# EAGLE design board (EAGLE 9.6.2)

## Sheet 1 of 2
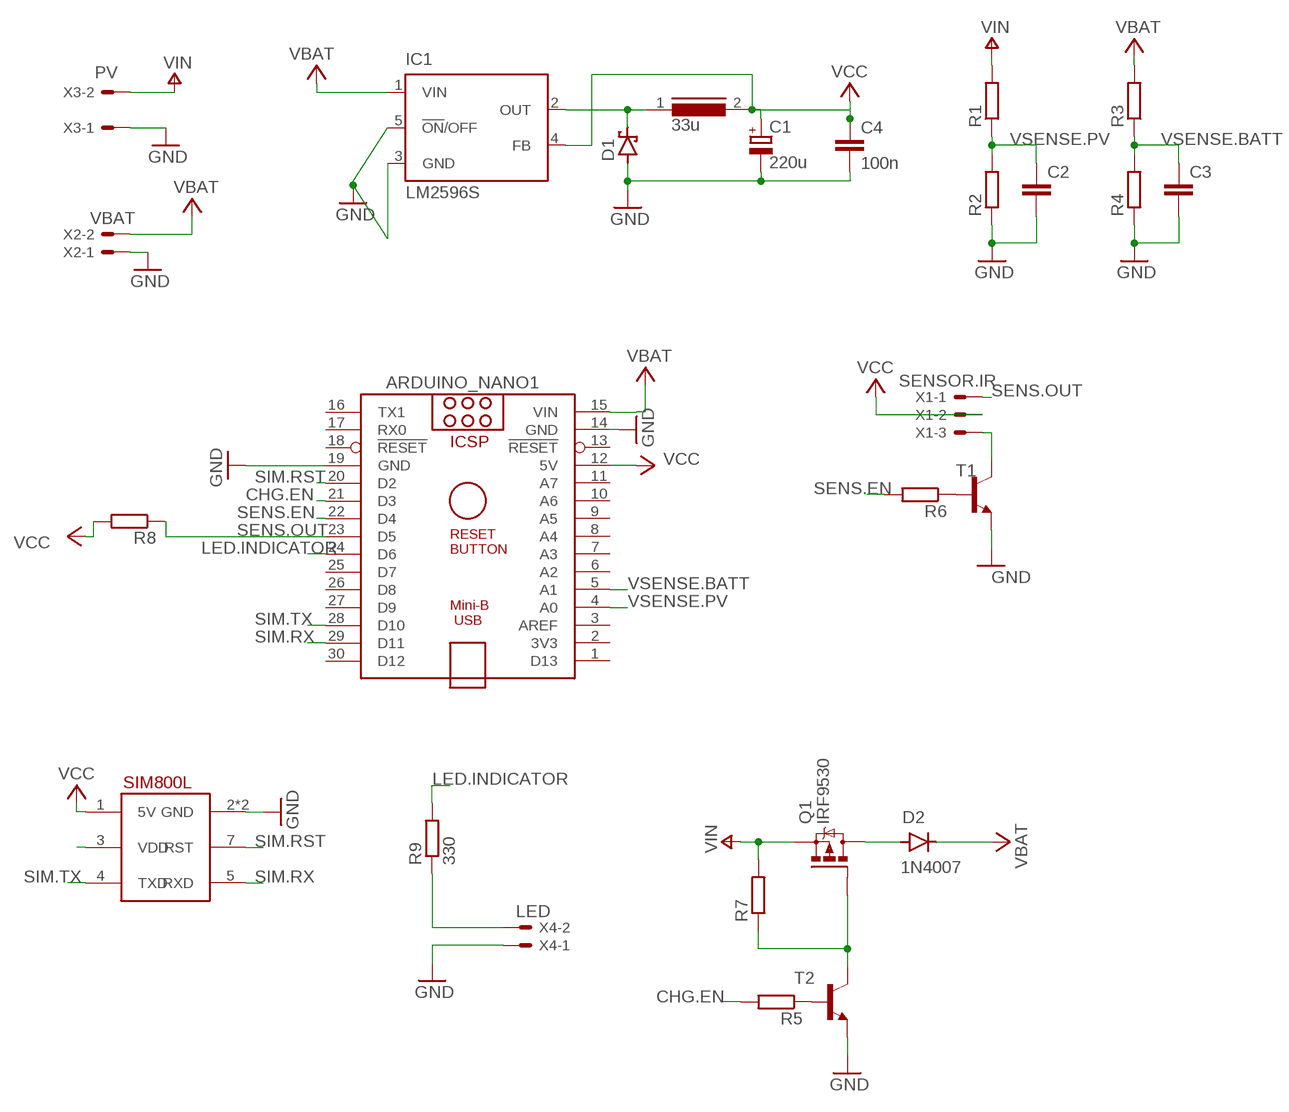
[diagram p0: schematic, sheet 1]

### Parts
ARDUINO_NANO1  ARDUINO_NANO  [ARDUINO_NANO]
C1  220u  CPOL-EU153CLV-0810  [153CLV-0810]
C2  C-EUC0805  [C0805]
C3  C-EUC0805  [C0805]
C4  100n  C-EUC0805  [C0805]
D1  SCHOTTKY-DIODESMD  [SMB]
D2  1N4007  [DO-41]
IC1  LM2596S  [TO263-5]
L2  33u  DR125  [DR125]
Q1  IRF9530  [TO220BV]
R1  R-EU_R0805  [R0805]
R2  R-EU_R0805  [R0805]
R3  R-EU_R0805  [R0805]
R4  R-EU_R0805  [R0805]
R5  R-EU_0207/7  [0207/7]
R6  R-EU_0207/7  [0207/7]
R7  R-EU_0207/7  [0207/7]
R8  R-EU_0207/7  [0207/7]
R9  330  R-EU_R0805  [R0805]
T1  -NPN-TO92-ECB  [TO92-ECB]
T2  -NPN-TO92-ECB  [TO92-ECB]
U$1  SIM800L  [SIP]
X1  SENSOR.IR  JST-XH-03-PIN-LONG-PAD  [JST-XH-03-PACKAGE-LONG-PAD]
X2  VBAT  JST-XH-02-PIN-LONG-PAD  [JST-XH-02-PACKAGE-LONG-PAD]
X3  PV  KK-156-2  [KK-156-2]
X4  LED  JST-XH-02-PIN-LONG-PAD  [JST-XH-02-PACKAGE-LONG-PAD]

### Nets
+5V: ARDUINO_NANO1.15(VIN) D2.C IC1.1(VIN) R3.2 X2.2 ; supply symbol labelled VBAT
CHG.EN: ARDUINO_NANO1.21(D3) R5.2
GND: ARDUINO_NANO1.14(GND) ARDUINO_NANO1.19(GND) C1.- C2.2 C3.2 C4.2 D1.A IC1.3(GND) IC1.5(!ON!/OFF) R2.1 R4.1 T1.E T2.E U$1.2(GND) U$1.6(GND) X2.1 X3.1 X4.1
LED.INDICATOR: ARDUINO_NANO1.24(D6) R9.2
N$4: T1.C X1.3
N$5: R6.1 T1.B
N$7: U$1.3(VDD)
N$8: R9.1 X4.2
N$9: D1.C IC1.2(OUT) L2.1
N$14: Q1.G R7.1 T2.C
N$19: D2.A Q1.D
N$20: R5.1 T2.B
SENS.EN: ARDUINO_NANO1.22(D4) R6.2
SENS.OUT: ARDUINO_NANO1.23(D5) R8.1 X1.1
SIM.RST: ARDUINO_NANO1.20(D2) U$1.7(RST)
SIM.RX: ARDUINO_NANO1.29(D11) U$1.5(RXD)
SIM.TX: ARDUINO_NANO1.28(D10) U$1.4(TXD)
V+: Q1.S R1.2 R7.2 X3.2 ; supply symbol labelled VIN
VCC: ARDUINO_NANO1.12(5V) C1.+ C4.1 IC1.4(FB) L2.2 R8.2 U$1.1(5V) X1.2
VSENSE.BATT: ARDUINO_NANO1.5(A1) C3.1 R3.1 R4.2
VSENSE.PV: ARDUINO_NANO1.4(A0) C2.1 R1.1 R2.2
Unconnected: ARDUINO_NANO1.1(D13) ARDUINO_NANO1.2(3V3) ARDUINO_NANO1.3(AREF) ARDUINO_NANO1.6(A2) ARDUINO_NANO1.7(A3) ARDUINO_NANO1.8(A4) ARDUINO_NANO1.9(A5) ARDUINO_NANO1.10(A6) ARDUINO_NANO1.11(A7) ARDUINO_NANO1.13(!RESET) ARDUINO_NANO1.16(TX1) ARDUINO_NANO1.17(RX0) ARDUINO_NANO1.18(!RESET) ARDUINO_NANO1.25(D7) ARDUINO_NANO1.26(D8) ARDUINO_NANO1.27(D9) ARDUINO_NANO1.30(D12)

## Sheet 2 of 2

## Library data of the parts
ARDUINO_NANO1 = ArduinoNanoV30:ARDUINO_NANO: Arduino Nano V3.0 Overview: The Arduino Nano is a small, complete, and breadboard-friendly board based on the ATmega328 (Arduino Nano 3.x) or ATmega168 (Arduino Nano 2.x). It has more or less the same functionality of the Arduino Duemilanove, but in a different package. It lacks only a DC power jack, and works with a Mini-B USB cable instead of a standard one. The Nano was designed and is being produced by Gravitech. Specifications: Microcontroller Atmel ATmega168 or ATmega328 Operating Voltage (logic level) 5 V Input Voltage (recommended) 7-12 V Input Voltage (limits) 6-20 V Digital I/O Pins 14 (of which 6 provide PWM output) Analog Input Pins 8 DC Current per I/O Pin 40 mA Flash Memory 16 KB (ATmega168) or 32 KB (ATmega328) of which 2 KB used by bootloader SRAM 1 KB (ATmega168) or 2 KB (ATmega328) EEPROM 512 bytes (ATmega168) or 1 KB (ATmega328) Clock Speed 16 MHz Dimensions 0.73" x 1.70" Length 45 mm Width 18 mm Weigth 5 g Power: The Arduino Nano can be powered via the Mini-B USB connection, 6-20V unregulated external power supply (pin 30), or 5V regulated external power supply (pin 27). The power source is automatically selected to the highest voltage source. Memory: The ATmega168 has 16 KB of flash memory for storing code (of which 2 KB is used for the bootloader); the ATmega328 has 32 KB, (also with 2 KB used for the bootloader). The ATmega168 has 1 KB of SRAM and 512 bytes of EEPROM (which can be read and written with the EEPROM library); the ATmega328 has 2 KB of SRAM and 1 KB of EEPROM. Input and Output: Each of the 14 digital pins on the Nano can be used as an input or output, using pinMode(), digitalWrite(), and digitalRead() functions. They operate at 5 volts. Each pin can provide or receive a maximum of 40 mA and has an internal pull-up resistor (disconnected by default) of 20-50 kOhms. In addition, some pins have specialized functions. Visit Arduino - ArduinoBoardNano <https://www.arduino.cc/en/Main/ArduinoBoardNano>
C1 = rcl:CPOL-EU: POLARIZED CAPACITOR, European symbol; SPICEPREFIX: C
C2-C4 = rcl:C-EU: CAPACITOR, European symbol; SPICEPREFIX: C
D1 = diode:SCHOTTKY-DIODE: Schottky Diode
D2 = Diodes:1N4007: DIODE GEN PURP 1KV 1A DO41 Manufacturer's datasheet <https://www.mccsemi.com/pdf/Products/1N4001-1N4007(DO-41).pdf>; CREATED_BY: PCBLayout.com; DIGIKEY_PART_NUMBER: 1N4007MSCT-ND; MANUFACTURER: Micro Commercial Co; MPN: 1N4007; PACKAGE: DO-41
IC1 = national-semiconductor:LM2596: SIMPLE SWITCHER® Power Converter 150 kHz 3A Step-Down Voltage Regulator Source: http://www.national.com/ds/LM/LM2596.pdf; MF: NATIONAL SEMICONDUCTOR; MPN: LM2596S-ADJ/NOPB; OC_FARNELL: 9494367; OC_NEWARK: 41K3842
L2 = DR125:DR125: High Power Density, High Efficiency, Shielded Inductors Source: coiltronics_dr_series.pdf; SPICEPREFIX: L
Q1 = transistor-power:IRF9530: P-CHANNEL HEXFET POWER-MOS-FET Source: http://www.irf.com/product-info/datasheets/data/irf9530.pdf
R1-R9 = rcl:R-EU_: RESISTOR, European symbol; SPICEPREFIX: R
T1 T2 = transistor:*-NPN-: NPN Transistror BF959 corrected 2008.03.06
U$1 = SIM800L:SIM800L: SIM800L Blue EVB Board with Level Translation and diode dropper.
X1 = Rembrandt Electronics - JST XH Connectors v1-0-2-2-2-2:JST-XH-03-PIN: JST XH Connector 2 Pin Wire to board connector. Pitch: 2,54 mm, (0.100") Number of pins: 3 Created by Rembrandt Electronics www.rembrandtelectronics.com
X2 X4 = Rembrandt Electronics - JST XH Connectors v1-0-2-2-2-2:JST-XH-02-PIN: JST XH Connector 2 Pin Wire to board connector. Pitch: 2,54 mm, (0.100") Number of pins: 2 Created by Rembrandt Electronics www.rembrandtelectronics.com
X3 = con-molex:KK-156-2: KK 156 HEADER Source: http://www.molex.com/pdm_docs/sd/026604100_sd.pdf; MF: MOLEX; OC_FARNELL: unknown; OC_NEWARK: unknown

## Board
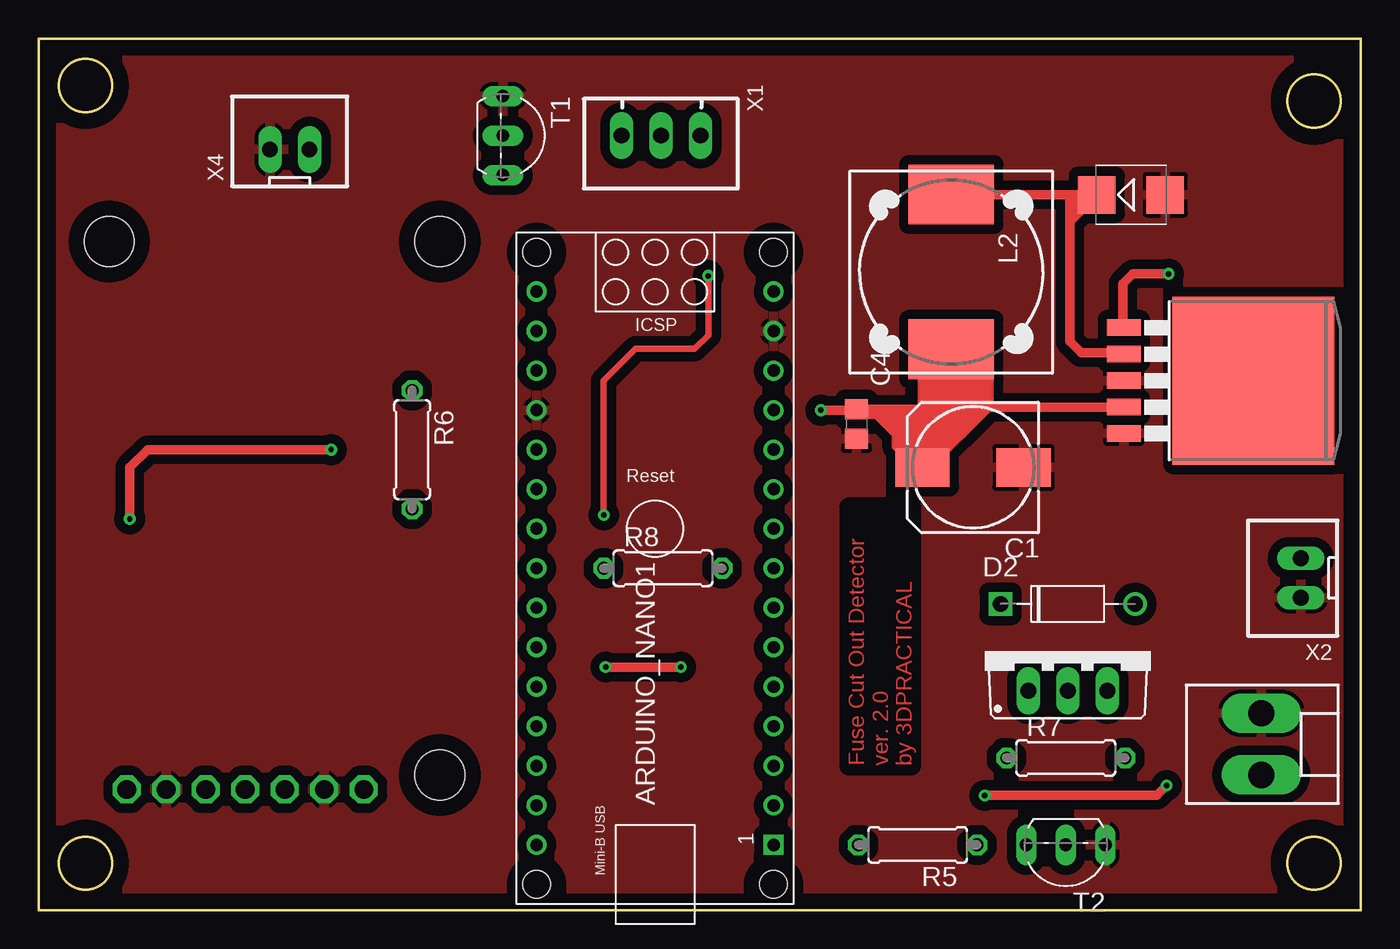
[diagram p1: board, top side]
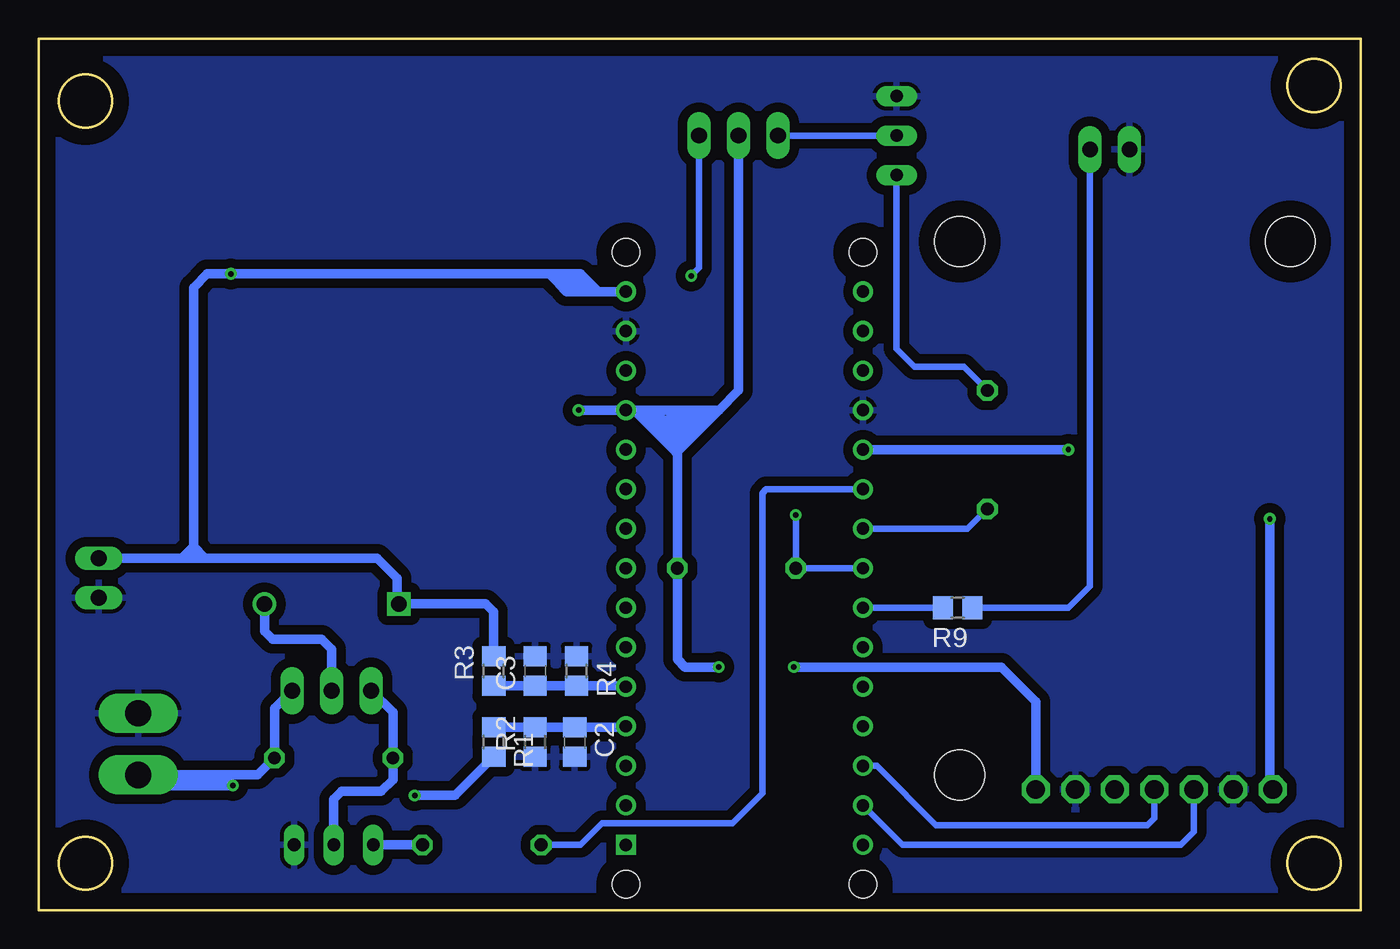
[diagram p2: board, bottom side, seen from below]

Size 85 x 56 mm. Coordinates in mm from the lower left corner, seen from the top.
Outline: 0,56 0,0 85,0 85,56 0,56
Outline: circle at 82,3 radius 1.7
Outline: circle at 82,52 radius 1.7
Outline: circle at 3,3 radius 1.7
Outline: circle at 3,53 radius 1.7
Copper layers (1*16): Top 0.035mm / dielectric 1.5mm / Bottom 0.035mm
Design rules "default": minimum track width 6mil, minimum drill 0.35mm, track to track 6mil, track to pad 6mil, pad to pad 6mil, via to via 6mil, smd to smd 6mil, copper to edge 40mil, drill to drill 6mil, minimum pad ring 10mil, minimum via ring 8mil, stop-mask expansion 4mil, vias tented up to drill 0mil, thermal gap 10mil

### Footprints (pad centres in the part's own frame; a part is rotated, then mirrored left to right if it is on the bottom)
ARDUINO_NANO = drill 0.8 square: 1 -20.32,-7.62 | drill 0.8: 2 -17.78,-7.62; 3 -15.24,-7.62; 4 -12.7,-7.62; 5 -10.16,-7.62; 6 -7.62,-7.62; 7 -5.08,-7.62; 8 -2.54,-7.62; 9 0,-7.62; 10 2.54,-7.62; 11 5.08,-7.62; 12 7.62,-7.62; 13 10.16,-7.62; 14 12.7,-7.62; 15 15.24,-7.62; 16 15.24,7.62; 17 12.7,7.62; 18 10.16,7.62; 19 7.62,7.62; 20 5.08,7.62; 21 2.54,7.62; 22 0,7.62; 23 -2.54,7.62; 24 -5.08,7.62; 25 -7.62,7.62; 26 -10.16,7.62; 27 -12.7,7.62; 28 -15.24,7.62; 29 -17.78,7.62; 30 -20.32,7.62 | hole 1.778: -22.86,-7.62; -22.86,7.62; 17.78,7.62; 17.78,-7.62
153CLV-0810 = smd 3.5 x 2.5: + 3.25,0; - -3.25,0
C0805 = smd 1.3 x 1.5: 1 -0.95,0; 2 0.95,0
SMB = smd 2.4 x 2.4: A 2.2,0; C -2.2,0
DO-41 = drill 1: A 4.325,0 | drill 1 square: C -4.325,0
TO263-5 = smd 1.067 x 2.159: 1 -3.404,-5.791; 2 -1.702,-5.791; 3 0,-5.791; 4 1.702,-5.791; 5 3.404,-5.791 | smd 10.8 x 10.41: 6 0,2.54
DR125 = smd 3.85 x 5.5: 1 -4.975,0; 2 4.975,0
TO220BV = drill 1.016 long: D 0,-2.54; G -2.54,-2.54; S 2.54,-2.54
R0805 = smd 1.3 x 1.5: 1 -0.95,0; 2 0.95,0
0207/7 = drill 0.813 octagon: 1 -3.81,0; 2 3.81,0
TO92-ECB = drill 0.813 long: B 2.54,0; C 0,0; E -2.54,0
SIP = drill 1.2 octagon: 1 38.1,19.24; 2 38.1,16.7; 3 38.1,14.16; 4 38.1,11.62; 5 38.1,9.08; 6 38.1,6.54; 7 38.1,4 | hole 3.2: 2.87,24.13; 2.87,2.87; 37.16,24.13
JST-XH-03-PACKAGE-LONG-PAD = drill 1.016 long: 1 -2.54,0; 2 0,0; 3 2.54,0
JST-XH-02-PACKAGE-LONG-PAD = drill 1.016 long: 1 -1.27,0; 2 1.27,0
KK-156-2 = drill 1.7 pad 2.184 long: 1 -1.98,0; 2 1.98,0

### Placement (x,y rotation side)
ARDUINO_NANO1  39.62,24.51 90 top
C1  60.07,28.45 180 top
C2  50.55,10.79 270 bottom
C3  53.09,15.37 90 bottom
C4  52.58,31.24 270 top
D1  70.23,45.97 0 top
D2  66.17,19.68 0 top
IC1  75.56,34.04 270 top
L2  58.67,41.02 270 top
Q1  66.17,16.64 0 top
R1  55.75,10.79 270 bottom
R2  53.09,10.79 90 bottom
R3  55.75,15.37 90 bottom
R4  50.42,15.37 270 bottom
R5  56.52,4.19 180 top
R6  24,29.59 270 top
R7  66.04,9.78 0 top
R8  40.13,21.97 0 top
R9  25.91,19.43 180 bottom
T1  29.84,49.78 270 top
T2  66.04,4.19 180 top
U$1  1.65,45.85 270 top
X1  40.01,49.78 180 top
X2  81.15,21.34 90 top
X3  78.61,10.67 270 top
X4  16.13,48.9 0 top

### Tracks (layer width: path | path; a pad name or v marks a point on that pad's centre or on a via)
+5V  (via drill 0.35)
  Top 0.61: v72.64,40.89 70.36,40.89 69.72,40.26 69.72,37.49 IC1.1
  Bottom 0.61: R3.2 55.75,19.18 56.26,19.68 D2.C 61.98,19.82 61.98,21.34 63.25,22.61 74.3,22.61 | 52.2,40.89 v72.64,40.89 74.17,40.89 75.06,40.01 75.06,23.37 | 52.2,40.89 51.56,40.89 | 51.56,40.89 51.18,40.89 | 51.18,40.89 50.8,40.89 | 50.8,40.89 50.04,40.13 | 50.04,40.13 49.66,39.75 | 49.66,39.75 49.02,39.75 | 49.02,39.75 ARDUINO_NANO1.15 | X2.2 75.82,22.61 | 75.82,22.61 74.8,22.61 | 74.8,22.61 74.3,22.61 | 75.06,23.37 75.82,22.61 | 75.06,23.37 75.06,22.86 74.8,22.61 | 75.06,23.37 74.3,22.61 | 50.8,39.75 51.05,39.75 51.56,40.26 | 50.8,39.75 49.66,39.75 | 51.56,40.89 51.56,40.26 | 51.18,40.89 50.8,40.51 50.8,40.13 | 50.8,39.75 50.8,40.13 | 51.56,40.89 50.8,40.13 | 50.8,40.13 50.04,40.13 | 49.02,39.75 50.16,40.89 50.8,40.89 | 51.56,40.26 52.2,40.89
CHG.EN
  Bottom 0.406: R5.2 50.16,4.19 48.77,5.59 40.39,5.59 38.48,7.49 38.48,26.8 38.23,27.05 ARDUINO_NANO1.21
GND
  pour Bottom (isolate 0.61): 0,56.01 0,0 85.09,0 85.09,56.01
  pour Top (isolate 0.61): -0.13,56.01 -0.13,-0.13 85.09,-0.13 85.09,56.01
LED.INDICATOR
  Bottom 0.406: R9.2 ARDUINO_NANO1.24
N$4
  Bottom 0.406: T1.C X1.3
N$5
  Bottom 0.406: T1.B 29.84,36.07 28.7,34.92 25.53,34.92 R6.1
N$8
  Bottom 0.406: X4.2 17.4,20.83 18.8,19.43 R9.1
N$9
  Top 0.61: 67.03,44.98 D1.C 68.01,46 66.67,46 | 67.03,44.98 66.29,44.24 | 66.29,44.24 66.29,36.58 67.06,35.81 69.7,35.81 IC1.2 | L2.1 61.74,46 62.36,46 66.29,46 | 66.67,46 66.29,46 | 66.29,45.72 66.29,44.24 | 66.29,46 66.29,45.72 | 66.29,45.72 66.74,45.28 | 66.74,45.28 67.03,44.98 | 66.67,46 66.74,45.93 66.74,45.28
N$14
  Bottom 0.61: Q1.G 62.23,12.7 R7.1 62.23,8.38 62.99,7.62 65.53,7.62 66.04,7.11 T2.C
N$19
  Bottom 0.61: Q1.D 66.17,16.76 66.8,17.4 69.98,17.4 70.49,17.91 D2.A
N$20
  Bottom 0.61: R5.1 T2.B
SENS.EN
  Bottom 0.406: R6.2 25.27,24.51 ARDUINO_NANO1.22
SENS.OUT  (via drill 0.35)
  Top 0.406: v36.32,25.4 36.32,34.04 38.35,36.07 42.16,36.07 43.05,36.96 v43.05,40.77
  Bottom 0.406: ARDUINO_NANO1.23 R8.1 v36.32,25.4 | v43.05,40.77 42.55,41.27 X1.1
SIM.RST  (via drill 0.35)
  Top 0.61: v18.8,29.59 6.99,29.59 5.84,28.45 v5.84,25.15
  Bottom 0.61: ARDUINO_NANO1.20 v18.8,29.59 | v5.84,25.15 5.84,7.94 U$1.7
SIM.RX
  Bottom 0.406: ARDUINO_NANO1.29 29.46,4.19 11.56,4.19 10.73,5.02 U$1.5
SIM.TX
  Bottom 0.406: U$1.4 13.27,5.91 13.72,5.46 27.3,5.46 31.11,9.27 ARDUINO_NANO1.28
V+  (via drill 0.35)
  Top 0.61: v60.83,7.37 71.88,7.37 v72.52,8
  Bottom 0.61: 74.55,8.69 73.66,8.69 | 73.66,8.69 72.97,8.69 | 72.77,8.69 70.94,8.69 R7.2 69.85,12.95 Q1.S | v72.52,8 73.03,8 | 73.03,8 73.66,8 | 75.69,8 75.24,8 | 75.24,8 74.68,8 | 73.03,8 72.77,8.26 72.77,8.69 | 72.97,8.69 72.77,8.69 | 74.35,8 73.66,8 | 73.66,8 72.97,8.69 | 74.68,8 74.35,8 | 74.35,8 73.66,8.69 | 74.68,8 74.55,8.13 74.55,8.69 | 75.24,8 74.55,8.69 | 75.82,8.69 75.44,8.69 | 75.44,8.69 74.93,8.69 | 74.93,8.69 74.55,8.69 | 75.44,8.69 75.69,8.43 75.69,8 | 76.45,8 75.69,8 | 74.93,8.69 75.24,8.38 75.24,8 | 75.82,8.69 76.45,8.05 76.45,8 | 76.45,8 77.93,8 X3.2 75.82,8.69 | R1.2 58.23,7.37 v60.83,7.37
VCC  (via drill 0.35)
  Top 0.152: L2.2 59.71,36.05 60.71,35.05
  Top 0.61: IC1.4 61.09,32.33 | 61.09,32.33 60.71,32.33 | 60.71,32.33 60.25,32.33 | 58.67,33.91 58.67,34.54 | 58.67,34.54 58.67,34.92 | 58.67,34.92 L2.2 | 60.25,32.33 59.88,32.7 | 59.88,32.7 59.56,33.02 | 59.56,33.02 59.31,33.27 | 59.31,33.27 59.05,33.53 | 59.05,33.53 58.67,33.91 | 60.25,32.33 56.82,28.91 C1.+ | 56.82,30.11 56.82,30.23 | 56.82,30.23 56.82,30.73 | 56.82,30.74 56.82,31.37 | 56.82,31.37 56.82,32.13 | 56.82,33.02 56.82,33.91 | 56.82,33.91 56.82,35.36 57.53,36.07 58.67,34.92 | C1.+ 56.82,29.64 | 56.82,29.64 59.88,32.7 | 56.82,30.23 59.56,32.97 59.56,33.02 | 56.82,30.73 59.31,33.22 59.31,33.27 | 56.82,31.37 57.43,31.98 | 57.43,31.98 57.81,32.36 | 57.81,32.36 58.73,33.27 59.31,33.27 | 56.82,32.13 56.88,32.19 | 56.88,32.19 58.13,33.44 | 58.13,33.44 58.6,33.91 | 58.6,33.91 58.67,33.91 | 58.67,34.54 58.34,34.54 58.06,34.26 | 56.82,32.13 56.82,33.02 | 56.82,33.02 57.3,33.5 | 57.68,33.88 57.81,34.01 | L2.2 58.67,35.76 57.68,34.77 | 57.68,34.77 57.05,34.14 | 57.05,34.14 56.82,33.91 | L2.2 58.67,33.98 58.6,33.91 | 57.43,31.98 57.43,33.38 | 57.43,33.38 57.3,33.5 | 57.81,32.36 57.81,34.01 | 57.81,34.01 58.06,34.26 | 58.13,33.44 58.13,34.2 58.06,34.26 | 57.3,33.5 57.68,33.88 | 57.68,33.88 57.68,34.77 | 57.43,33.38 57.43,33.76 57.05,34.14 | C1.+ 60.71,32.33 | 60.71,34.01 60.71,32.33 | 59.88,34.84 60.25,34.47 60.25,32.33 | 59.56,35.16 59.88,34.84 | 59.88,34.84 59.88,32.7 | 59.17,35.55 59.56,35.16 | 59.56,35.16 59.56,33.02 | L2.2 59.05,35.66 59.05,33.53 | 61.09,33.63 61.09,33.02 61.09,32.33 | C1.+ 57.2,28.45 61.09,32.33 | L2.2 59.17,35.55 | 59.56,35.16 60.71,34.01 | 60.71,34.01 61.09,33.63 | 56,32.19 56.88,32.19 | C4.1 53.85,32.19 | 54.36,32.19 53.85,32.19 | 54.36,32.19 54.74,32.19
  Top 0.61: 54.74,32.19 55.37,32.19 | 55.37,32.19 56,32.19 | 56,32.19 56.82,31.37 | 55.37,32.19 56.82,30.74 | 56.82,30.74 56.82,30.73 | 54.74,32.19 55.15,31.78 | 55.15,31.78 56.82,30.11 | 56.82,30.11 56.82,29.73 | 54.36,32.19 56.82,29.73 | 56.82,29.73 56.82,29.64 | 53.85,32.19 56.26,29.78 56.26,29.46 | 56.26,29.46 56.26,28.7 55.15,29.81 55.15,31.78 | 55.44,30.29 53.85,31.88 52.89,31.88 C4.1 | 55.44,30.29 56.26,29.46 | C1.+ 55.44,29.83 55.44,30.29 | C4.1 52.52,32.13 v50.29,32.13 | v36.45,15.62 v41.27,15.62 | 60.71,35.05 60.71,34.01 | 61.09,33.63 61.09,35.56 59.18,35.56 59.17,35.55
  Bottom 0.61: v50.29,32.13 ARDUINO_NANO1.12 46.74,32.13 | 46.74,32.13 45.97,32.13 | 45.97,32.13 45.47,32.13 | 45.47,32.13 44.83,31.5 | 44.83,31.5 43.94,30.61 | 43.94,30.1 43.94,30.61 | 43.94,29.46 R8.2 43.94,16.13 43.43,15.62 v41.27,15.62 | 43.94,29.46 43.94,30.1 | X1.2 40.01,33.4 41.27,32.13 | 41.91,32.13 41.27,32.13 | 41.91,32.13 42.55,32.13 | 42.55,32.13 43.18,32.13 | 43.18,32.13 43.94,32.13 | 45.47,32.13 43.94,32.13 | 43.94,30.73 43.94,31.5 | 43.94,32.13 43.94,31.5 | 43.94,31.5 44.58,31.5 | 43.94,32.13 44.58,31.5 | 44.58,31.5 44.83,31.5 | 43.94,30.1 45.97,32.13 | 43.94,31.5 43.81,31.5 43.18,32.13 | 43.94,30.61 43.94,30.73 | 43.94,30.73 42.55,32.13 | 43.94,30.1 41.91,32.13 | 41.27,32.13 43.94,29.46 | 43.94,29.46 44.07,29.46 46.74,32.13 | U$1.1 20.89,13.4 23.11,15.62 v36.45,15.62
VSENSE.BATT
  Bottom 0.61: ARDUINO_NANO1.5 47.31,14.42 R4.2 C3.1 R3.1
VSENSE.PV
  Bottom 0.61: ARDUINO_NANO1.4 47.31,11.74 C2.1 R2.2 R1.1

### Text on the board
Top: Fuse Cut Out Detector / ver. 2.0 / by 3DPRACTICAL